# Altium project lps_regulator_rev_12.PrjPcb
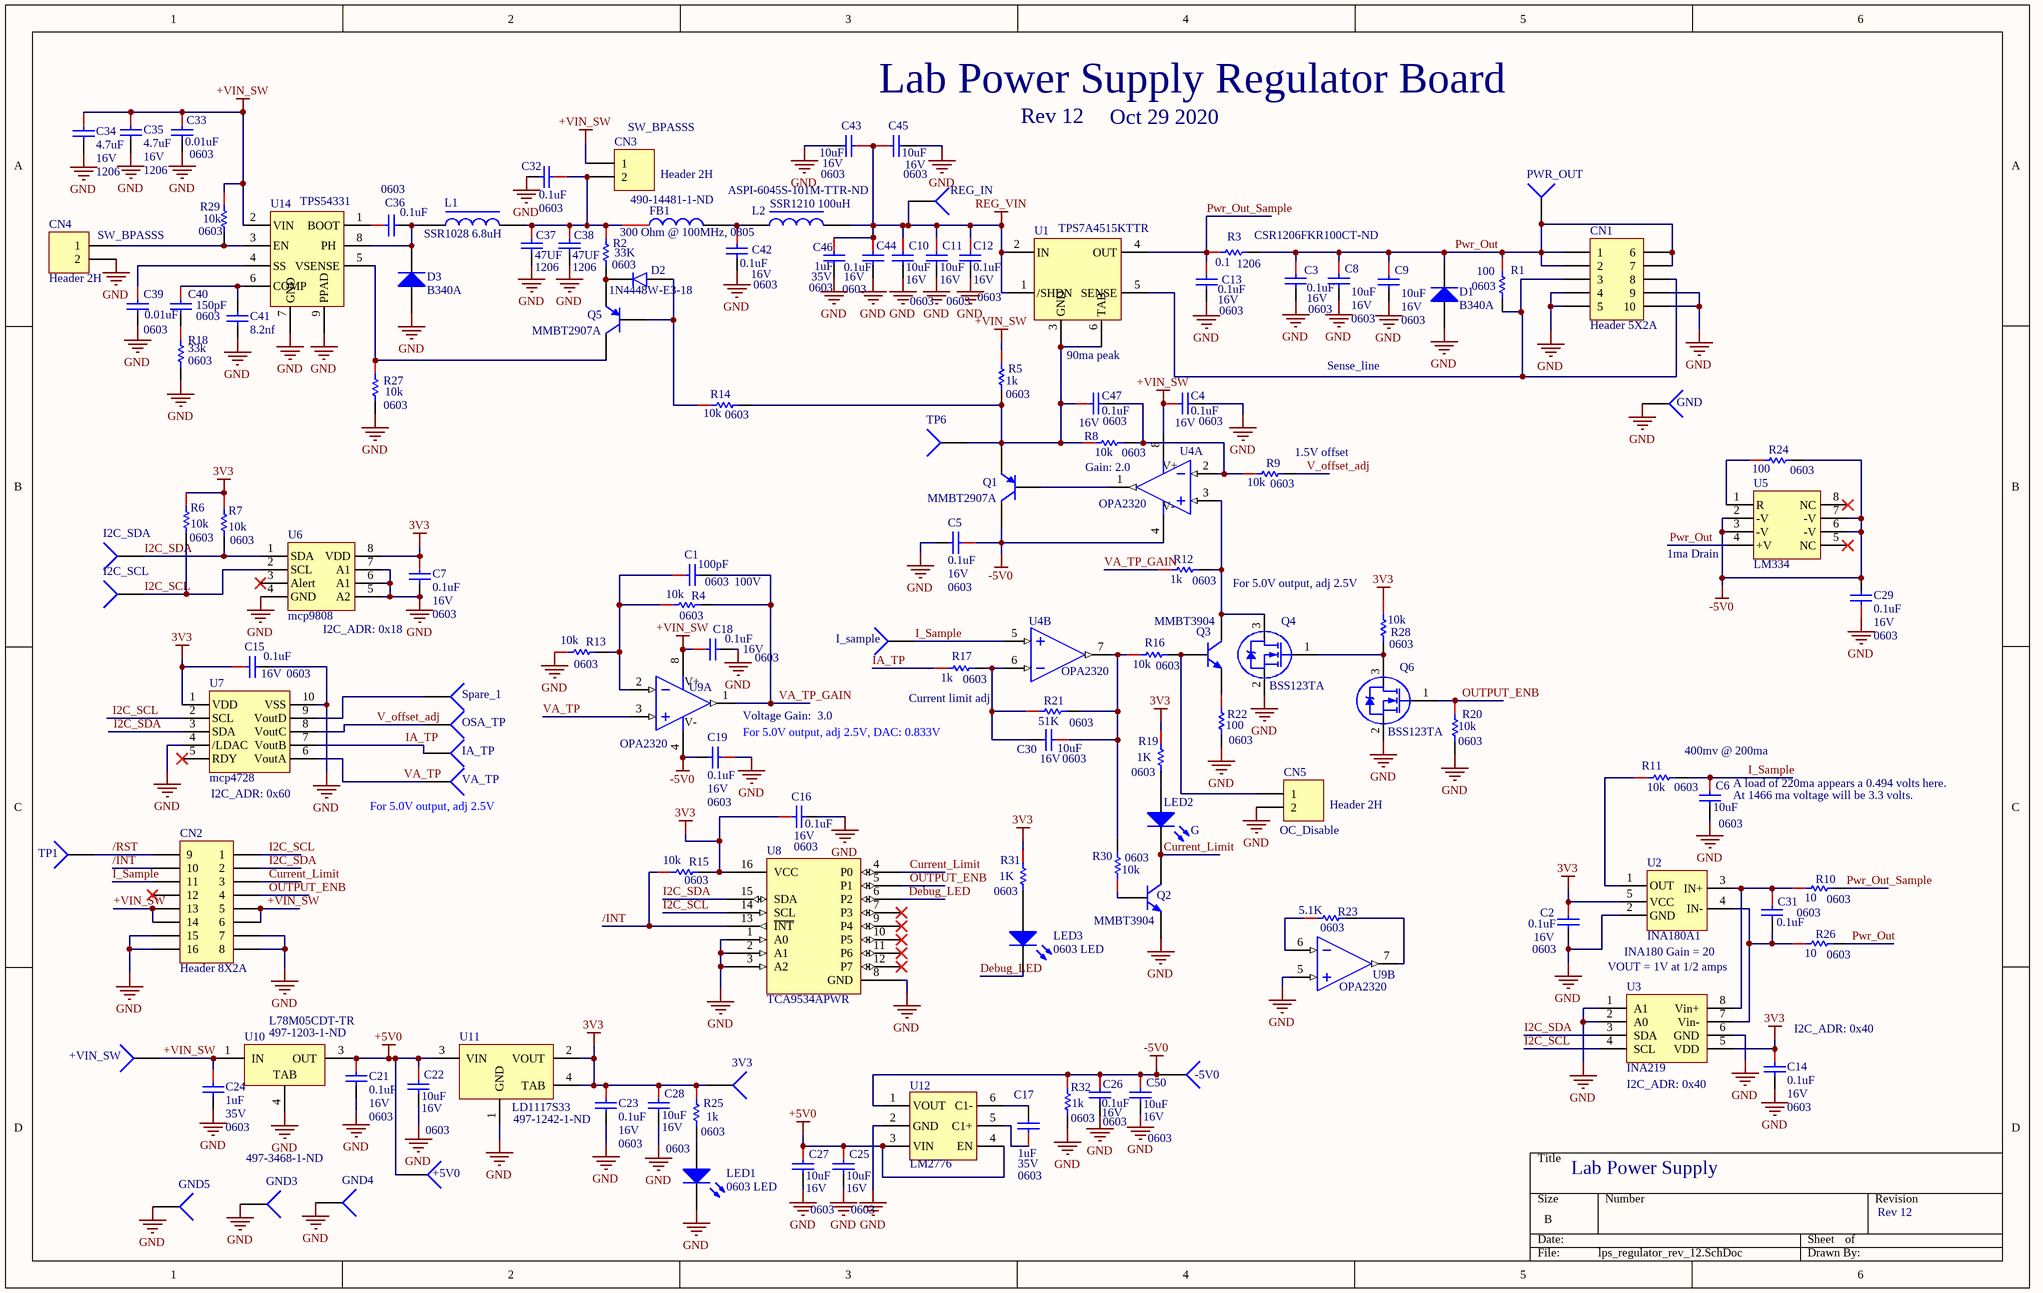
[diagram p0: lps_regulator_rev_12.SchDoc]
1 sheet, 131 parts. Net scope: global (net labels, ports and power ports of the same name join across sheets).
Board file: lps_regulator_rev_12.PcbDoc

## Sheet lps_regulator_rev_12.SchDoc
size B; Revision: B

### Parts
3V3  TestPoint_BLK  [TestPoint-TH 42 mil]  (value not drawn)
+5V0  TestPoint_BLK  [TestPoint-TH 42 mil]  (value not drawn)
+VIN_SW  TestPoint_BLK  [TestPoint-TH 42 mil]  (value not drawn)
-5V0  TestPoint_BLK  [TestPoint-TH 42 mil]  (value not drawn)
C1  100pF  Voltage (Rated): 100V  Package (Imperial): 0603  [CAPC0603(1608)_N]
C2  0.1uF  Voltage (Rated): 16V  Package (Imperial): 0603  [CAPC0603(1608)_M]
C3  0.1uF  Voltage (Rated): 16V  Package (Imperial): 0603  [CAPC0603(1608)_N]
C4  0.1uF  Voltage (Rated): 16V  Package (Imperial): 0603  [CAPC0603(1608)_N]
C5  0.1uF  Voltage (Rated): 16V  Package (Imperial): 0603  [CAPC0603(1608)_N]
C6  10uF  Package (Imperial): 0603  [CAPC0603(1608)_N]
C7  0.1uF  Voltage (Rated): 16V  Package (Imperial): 0603  [CAPC0603(1608)_N]
C8  10uF  Voltage (Rated): 16V  Package (Imperial): 0603  [CAPC0603(1608)_N]
C9  10uF  Voltage (Rated): 16V  Package (Imperial): 0603  [CAPC0603(1608)_N]
C10  10uF  Voltage (Rated): 16V  Package (Imperial): 0603  [CAPC0603(1608)_N]
C11  10uF  Voltage (Rated): 16V  Package (Imperial): 0603  [CAPC0603(1608)_N]
C12  0.1uF  Voltage (Rated): 16V  Package (Imperial): 0603  [CAPC0603(1608)_N]
C13  0.1uF  Voltage (Rated): 16V  Package (Imperial): 0603  [CAPC0603(1608)_N]
C14  0.1uF  Voltage (Rated): 16V  Package (Imperial): 0603  [CAPC0603(1608)_N]
C15  0.1uF  Voltage (Rated): 16V  Package (Imperial): 0603  [CAPC0603(1608)_N]
C16  0.1uF  Voltage (Rated): 16V  Package (Imperial): 0603  [CAPC0603(1608)_N]
C17  1uF  Voltage (Rated): 35V  Package (Imperial): 0603  [CAPC0603(1608)_N]
C18  0.1uF  Voltage (Rated): 16V  Package (Imperial): 0603  [CAPC0603(1608)_N]
C19  0.1uF  Voltage (Rated): 16V  Package (Imperial): 0603  [CAPC0603(1608)_N]
C21  0.1uF  Voltage (Rated): 16V  Package (Imperial): 0603  [CAPC0603(1608)_N]
C22  10uF  Voltage (Rated): 16V  Package (Imperial): 0603  [CAPC0603(1608)_N]
C23  0.1uF  Voltage (Rated): 16V  Package (Imperial): 0603  [CAPC0603(1608)_N]
C24  1uF  Voltage (Rated): 35V  Package (Imperial): 0603  [CAPC0603(1608)_N]
C25  10uF  Voltage (Rated): 16V  Package (Imperial): 0603  [CAPC0603(1608)_N]
C26  0.1uF  Voltage (Rated): 16V  Package (Imperial): 0603  [CAPC0603(1608)_N]
C27  10uF  Voltage (Rated): 16V  Package (Imperial): 0603  [CAPC0603(1608)_N]
C28  10uF  Voltage (Rated): 16V  Package (Imperial): 0603  [CAPC0603(1608)_N]
C29  0.1uF  Voltage (Rated): 16V  Package (Imperial): 0603  [CAPC0603(1608)_N]
C30  10uF  Voltage (Rated): 16V  Package (Imperial): 0603  [CAPC0603(1608)_N]
C31  0.1uF  Package (Imperial): 0603  [CAPC0603(1608)_N]
C32  0.1uF  Package (Imperial): 0603  [CAPC0603(1608)_N]
C33  0.01uF  Package (Imperial): 0603  [CAPC0603(1608)_N]
C34  4.7uF  Voltage (Rated): 16V  Package (Imperial): 1206  [CAPC1206(3216)_N]
C35  4.7uF  Voltage (Rated): 16V  Package (Imperial): 1206  [CAPC1206(3216)_N]
C36  0.1uF  Package (Imperial): 0603  [CAPC0603(1608)_N]
C37  47UF  Package (Imperial): 1206  [CAPC1206(3216)_N]
C38  47UF  Package (Imperial): 1206  [CAPC1206(3216)_N]
C39  0.01uF  Package (Imperial): 0603  [CAPC0603(1608)_N]
C40  150pF  Package (Imperial): 0603  [CAPC0603(1608)_N]
C41  8.2nf  [CAPC1608X87X35ML15T15]
C42  0.1uF  Voltage (Rated): 16V  Package (Imperial): 0603  [CAPC0603(1608)_N]
C43  10uF  Voltage (Rated): 16V  Package (Imperial): 0603  [CAPC0603(1608)_N]
C44  0.1uF  Voltage (Rated): 16V  Package (Imperial): 0603  [CAPC0603(1608)_N]
C45  10uF  Voltage (Rated): 16V  Package (Imperial): 0603  [CAPC0603(1608)_N]
C46  1uF  Voltage (Rated): 35V  Package (Imperial): 0603  [CAPC0603(1608)_N]
C47  0.1uF  Voltage (Rated): 16V  Package (Imperial): 0603  [CAPC0603(1608)_N]
C50  10uF  Voltage (Rated): 16V  Package (Imperial): 0603  [CAPC0603(1608)_N]
CN1  Header 5X2A  [HDR2X5_CEN]
CN2  Header 8X2A  [HDR2X8_CEN]
CN3  Header 2H  [HDR1X2H]
CN4  Header 2H  [HDR1X2H]
CN5  Header 2H  [HDR1X2H]
D1  B340A  [DO-214AC]
D2  1N4448W-E3-18  [SOD123]
D3  B340A  [DO-214AC]
FB1  300 Ohm @ 100MHz, 0805  [RESC0805(2012)_N]
GND  TestPoint_BLK  [TestPoint-TH 42 mil]  (value not drawn)
GND3  TestPoint_BLK  [TestPoint-TH 42 mil]  (value not drawn)
GND4  TestPoint_BLK  [TestPoint-TH 42 mil]  (value not drawn)
GND5  TestPoint_BLK  [TestPoint-TH 42 mil]  (value not drawn)
I2C_SCL  TestPoint_BLK  [TestPoint-TH 42 mil]  (value not drawn)
I2C_SDA  TestPoint_BLK  [TestPoint-TH 42 mil]  (value not drawn)
I_sample  TestPoint_BLK  [TestPoint-TH 42 mil]  (value not drawn)
IA_TP  TestPoint_BLK  [TestPoint-TH 42 mil]  (value not drawn)
L1  SSR1028 6.8uH  [SRU1028]
L2  SSR1210 100uH  [SRR1210]
LED1  0603 LED  [SM-LED-0603]
LED2  G  [SM-LED-0603]
LED3  0603 LED  [SM-LED-0603]
OSA_TP  TestPoint_BLK  [TestPoint-TH 42 mil]  (value not drawn)
PWR_OUT  TestPoint_BLK  [TestPoint-TH 42 mil]  (value not drawn)
Q1  MMBT2907A  [SOT23]
Q2  MMBT3904  [SOT23]
Q3  MMBT3904  [SOT23]
Q4  BSS123TA  [SOT23-3L]
Q5  MMBT2907A  [SOT23]
Q6  BSS123TA  [SOT23-3L]
R1  Package (Imperial): 0603  [RESC0603(1608)_N]  (hidden comment: 100)
R2  Package (Imperial): 0603  Resistance: 33K  [RESC0603(1608)_N]  (hidden comment: 10K)
R3  Package (Imperial): 1206  Resistance: 0.1  [RESC1206(3216)_N]  (hidden comment: 0.33)
R4  Package (Imperial): 0603  [RESC0603(1608)_M]  (hidden comment: 10k)
R5  Package (Imperial): 0603  Resistance: 1k  [RESC0603(1608)_N]  (hidden comment: 10K)
R6  Package (Imperial): 0603  [RESC0603(1608)_N]  (hidden comment: 10K)
R7  Package (Imperial): 0603  [RESC0603(1608)_N]  (hidden comment: 10K)
R8  Package (Imperial): 0603  [RESC0603(1608)_N]  (hidden comment: 10K)
R9  Package (Imperial): 0603  [RESC0603(1608)_N]  (hidden comment: 10K)
R10  Package (Imperial): 0603  Resistance: 10  [RESC0603(1608)_M]  (hidden comment: 10K)
R11  Package (Imperial): 0603  [RESC0603(1608)_M]  (hidden comment: 10K)
R12  Package (Imperial): 0603  Resistance: 1k  [RESC0603(1608)_N]  (hidden comment: 1.0K)
R13  Package (Imperial): 0603  [RESC0603(1608)_M]  (hidden comment: 10k)
R14  Package (Imperial): 0603  [RESC0603(1608)_N]  (hidden comment: 10K)
R15  Package (Imperial): 0603  [RESC0603(1608)_M]  (hidden comment: 10k)
R16  Package (Imperial): 0603  Resistance: 10k  [RESC0603(1608)_N]  (hidden comment: 1.0K)
R17  Package (Imperial): 0603  Resistance: 1k  [RESC0603(1608)_N]  (hidden comment: 1.0K)
R18  Package (Imperial): 0603  [RESC0603(1608)_N]  (hidden comment: 33K)
R19  Package (Imperial): 0603  Resistance: 1K  [RESC0603(1608)_N]  (hidden comment: 1.0K)
R20  Package (Imperial): 0603  [RESC0603(1608)_N]  (hidden comment: 10K)
R21  Package (Imperial): 0603  Resistance: 51K  [RESC0603(1608)_N]  (hidden comment: 100K)
R22  Package (Imperial): 0603  Resistance: 100  [RESC0603(1608)_N]  (hidden comment: 1.0K)
R23  Package (Imperial): 0603  Resistance: 5.1K  [RESC0603(1608)_N]  (hidden comment: 100)
R24  Package (Imperial): 0603  [RESC0603(1608)_N]  (hidden comment: 100)
R25  Package (Imperial): 0603  Resistance: 1k  [RESC0603(1608)_N]  (hidden comment: 1.0K)
R26  Package (Imperial): 0603  Resistance: 10  [RESC0603(1608)_M]  (hidden comment: 10K)
R27  Package (Imperial): 0603  [RESC0603(1608)_L]  (hidden comment: 10K)
R28  Package (Imperial): 0603  [RESC0603(1608)_N]  (hidden comment: 10K)
R29  Package (Imperial): 0603  [RESC0603(1608)_N]  (hidden comment: 10K)
R30  Package (Imperial): 0603  Resistance: 10k  [RESC0603(1608)_N]  (hidden comment: 1.0K)
R31  Package (Imperial): 0603  Resistance: 1K  [RESC0603(1608)_N]  (hidden comment: 1.0K)
R32  Package (Imperial): 0603  Resistance: 1k  [RESC0603(1608)_N]  (hidden comment: 1.0K)
REG_IN  TestPoint_BLK  [TestPoint-TH 42 mil]  (value not drawn)
Spare_1  TestPoint_BLK  [TestPoint-TH 42 mil]  (value not drawn)
TP1  TestPoint_BLK  [TestPoint-TH 42 mil]  (value not drawn)
TP6  TestPoint_BLK  [TestPoint-TH 42 mil]  (value not drawn)
U1  TPS7A4515KTTR  [TPS7A4515KTTR]
U2  INA180A1  [SOT-23-5_MC]
U3  INA219  [INA219]
U4  OPA2320  [SOIC-8_NoPad]  (parts A,B of 2)
U5  LM334  [LM334]
U6  mcp9808  [8MSOP]
U7  mcp4728  [MCP4728]
U8  TCA9534APWR  [TCA9534APWR-Footprint-1]
U9  OPA2320  [SOIC-8_NoPad]  (parts A,B of 2)
U10  (no value)  [TO-252_N]
U11  LD1117S33  [DSO-G3]
U12  LM2776  [SOt-23-6]
U14  TPS54331  [TPS54331]
VA_TP  TestPoint_BLK  [TestPoint-TH 42 mil]  (value not drawn)

### Nets
3V3: 3V3.1 C2.1 C7.1 C14.1 C15.1 C16.1 C23.1 C28.1 R6.1 R7.1 R15.2 R19.1 R25.1 R28.1 R31.1 U2.5(VCC) U3.5(VDD) U6.8(VDD) U7.1(VDD) U8.16(VCC) U11.2(VOUT) U11.4(TAB)
+5V0: +5V0.1 C21.1 C22.1 C25.1 C27.1 U10.3(OUT) U11.3(VIN) U12.3(VIN) U12.4(EN)
+VIN_SW: +VIN_SW.1 C4.1 C18.1 C24.1 C33.1 C34.1 C35.1 CN2.5 CN2.6 CN2.13 CN2.14 CN3.1 R5.1 R29.1 U4.8(V+) U9.8(V+) U10.1(IN) U14.2(VIN)
-5V0: -5V0.1 C5.1 C19.2 C26.1 C29.2 C50.1 Q1.3(C) R24.2 R32.1 U4.4(V-) U5.2(-V) U5.3(-V) U5.6(-V) U5.7(-V) U9.4(V-) U12.1(VOUT)
GND: C2.2 C3.2 C4.2 C5.2 C6.2 C7.2 C8.2 C9.2 C10.2 C11.2 C12.2 C13.2 C14.2 C15.2 C16.2 C18.2 C19.1 C21.2 C22.2 C23.2 C24.2 C25.2 C26.2 C27.2 C28.2 C29.1 C32.2 C33.2 C34.2 C35.2 C37.2 C38.2 C39.2 C41.1 C42.2 C43.2 C44.2 C45.2 C46.2 C50.2 CN1.4 CN1.5 CN1.9 CN1.10 CN2.7 CN2.8 CN2.15 CN2.16 CN4.2 CN5.2 D1.1(A) D3.1(A) GND.1 GND3.1 GND4.1 GND5.1 LED1.2(Cathode) Q2.2(E) Q4.2(S) Q6.2(S) R13.1 R18.2 R20.2 R22.2 R27.2 R32.2 U2.2(GND) U3.1(A1) U3.2(A0) U3.6(GND) U6.4(GND) U6.5(A2) U6.6(A1) U6.7(A1) U7.4(/LDAC) U7.10(VSS) U8.1(A0) U8.2(A1) U8.3(A2) U8.8(GND) U9.5(INB+) U10.4(TAB) U11.1(GND) U12.2(GND) U14.7(GND) U14.9(PPAD)
REG_VIN: C10.1 C11.1 C12.1 C43.1 C44.1 C45.1 C46.1 L2.2 REG_IN.1 U1.1(/SHDN) U1.2(IN)
/INT: CN2.10 R15.1 U8.13(~{INT})
/RST: CN2.9 TP1.1
Current_Limit: CN2.3 LED2.2 Q2.3(C) U8.4(P0)
Debug_LED: LED3.2(Cathode) U8.6(P2)
I2C_SCL: CN2.1 I2C_SCL.1 R6.2 U3.4(SCL) U6.2(SCL) U7.2(SCL) U8.14(SCL)
I2C_SDA: CN2.2 I2C_SDA.1 R7.2 U3.3(SDA) U6.1(SDA) U7.3(SDA) U8.15(SDA)
I_Sample: C6.1 CN2.11 I_sample.1 R11.2 U4.5(INB+)
IA_TP: IA_TP.1 R17.1 U7.7(VoutB)
OUTPUT_ENB: CN2.4 Q6.1(G) R20.1 U8.5(P1)
Pwr_Out: C3.1 C8.1 C9.1 CN1.1 CN1.2 CN1.6 CN1.7 D1.2(K) PWR_OUT.1 R1.1 R3.2 R26.2 U5.4(+V)
Pwr_Out_Sample: C13.1 R3.1 R10.2 U1.4(OUT)
V_offset_adj: OSA_TP.1 R9.2 U7.8(VoutC)
VA_TP: U7.6(VoutA) U9.3(INA+) VA_TP.1
VA_TP_GAIN: C1.2 R4.2 R12.1 U9.1(OUTA)
NetC1_1: C1.1 R4.1 R13.2 U9.2(INA-)
NetC17_1: C17.1 U12.5(C1+)
NetC17_2: C17.2 U12.6(C1-)
NetC30_1: C30.1 R16.1 R21.2 R30.2 U4.7(OUTB)
NetC30_2: C30.2 R17.2 R21.1 U4.6(INB-)
NetC31_1: C31.1 R10.1 U2.3(IN+) U3.8(Vin+)
NetC31_2: C31.2 R26.1 U2.4(IN-) U3.7(Vin-)
NetC32_1: C32.1 C37.1 C38.1 CN3.2 FB1.1 L1.2 R2.1
NetC36_1: C36.1 U14.1(BOOT)
NetC36_2: C36.2 D3.2(K) L1.1 U14.8(PH)
NetC39_1: C39.1 U14.4(SS)
NetC40_1: C40.1 C41.2 U14.6(COMP)
NetC40_2: C40.2 R18.1
NetC42_1: C42.1 FB1.2 L2.1
NetC47_1: C47.1 Q1.2(E) R5.2 R8.1 R14.2 TP6.1 U1.3(GND) U1.6(TAB)
NetC47_2: C47.2 R8.2 R9.1 U4.2(INA-)
NetCN1_3: CN1.3 CN1.8 R1.2 U1.5(SENSE)
NetCN4_1: CN4.1 R29.2 U14.3(EN)
NetCN5_1: CN5.1 Q3.1(B) R16.2
NetD2_1: D2.1(A) Q5.1(B) R14.1
NetD2_2: D2.2(C) Q5.2(E) R2.2
NetLED1_1: LED1.1(Anode) R25.2
NetLED2_1: LED2.1 R19.2
NetLED3_1: LED3.1(Anode) R31.2
NetQ1_1: Q1.1(B) U4.1(OUTA)
NetQ2_1: Q2.1(B) R30.1
NetQ3_2: Q3.2(E) R22.1
NetQ3_3: Q3.3(C) Q4.3(D) R12.2 U4.3(INA+)
NetQ4_1: Q4.1(G) Q6.3(D) R28.2
NetQ5_3: Q5.3(C) R27.1 U14.5(VSENSE)
NetR11_1: R11.1 U2.1(OUT)
NetR23_1: R23.1 U9.6(INB-)
NetR23_2: R23.2 U9.7(OUTB)
NetR24_1: R24.1 U5.1(R)
NetSpare_1_1: Spare_1.1 U7.9(VoutD)

Not connected (* = marked no-connect by the designer): CN2 12*; U5 5(NC)* 8(NC)*; U6 3(Alert)*; U7 5(RDY)*; U8 7(P3)* 9(P4)* 10(P5)* 11(P6)* 12(P7)*

### Notes on the sheet
- Lab Power Supply Regulator Board
- (near CN3) SW_BPASSS
- Rev 12
- Oct 29 2020
- 490-14481-1-ND
- ASPI-6045S-101M-TTR-ND
- (near CN4) SW_BPASSS
- (near R3) CSR1206FKR100CT-ND
- 90ma peak
- Sense_line
- (near U4) Gain: 2.0
- (near R9) 1.5V offset
- (near U5) 1ma Drain
- I2C_ADR: 0x18
- For 5.0V output, adj 2.5V
- Current limit adj
- Voltage Gain:  3.0
- For 5.0V output, adj 2.5V, DAC: 0.833V
- 400mv @ 200ma
- (near U7) I2C_ADR: 0x60
- (near VA_TP) For 5.0V output, adj 2.5V
- (near CN5) OC_Disable
- (near C6) A load of 220ma appears a 0.494 volts here.
- (near C6) At 1466 ma voltage will be 3.3 volts.
- VOUT = 1V at 1/2 amps
- INA180 Gain = 20
- L78M05CDT-TR
- (near U10) 497-1203-1-ND
- (near C14) I2C_ADR: 0x40
- (near U3) I2C_ADR: 0x40
- 497-3468-1-ND
- 497-1242-1-ND
- Lab Power Supply

### Library data of the parts
3V3 +5V0 +VIN_SW -5V0 GND GND3-GND5 I2C_SCL I2C_SDA I_sample IA_TP OSA_TP PWR_OUT REG_IN Spare_1 TP1 TP6 VA_TP = CMP-005-0210-01: Test Point - Black; Manufacturer Part Number: 5001; Manufacturer: Keystone Electronics; Stock 1: 335679; Material: Base, Nylon 46, UL 94V-0; Terminal: 0.010" x 0.020" (0.25mm x 0.51mm) Phosphor Bronze Wire, Silver Plated; ComponentLink1URL: http://www.keyelco.com/product-pdf.cfm?p=1310; Packaging: Bulk; Mounting Type: 0.040" (1.02mm) Hole Diameter; Color: Black; Pin Count: 1; Component Name: TestPoint_BLK; Pricing 1: 1=0.37, 10=0.316, 50=0.2298, 100=0.2209, 250=0.19832, 500=0.18932, 1000=0.1616, 2500=0.14424, 5000=0.13523 (USD); ComponentLink1Description: http://www.keyelco.com/product-pdf.cfm?p=1310; RoHS: RoHS Compliant; Designator: TestPoint_BLK; Type: PC Test Point, Miniature
C1 = CMP-007-0074-08: CAP CER 100PF 50V 5% NP0 0603; Package (Metric): 1608; Dielectric Material: Ceramic; Temperature Coefficient: C0G, NP0; Capacitance: 100pF; Tolerance: 5%; Mounting Type: SMD
C2-C5 C7 C12-C16 C18 C19 C21 C23 C26 C29-C32 C36 C42 C44 C47 = CMP-007-0042-08: CAP CER 0.1UF 16V 10% X7R 0603; Package (Metric): 1608; Dielectric Material: Ceramic; Capacitance: 100nF; Tolerance: 10%; Temperature Coefficient: X7R; Mounting Type: SMD
  C31 C32 C36: Voltage (Rated): 16V
C6 C8-C11 C22 C25 C27 C28 C43 C45 C50 = CMP-001-0603-12: CAP CER 10UF 16V X5R 0603; Capacitance: 10µF; Tolerance: 10%; Package (Metric): 1005; Dielectric Material: Ceramic; Temperature (Max): 85°C; Temperature (Min): -55°C; Height: 800µm; Mounting Type: SMD; Width: 800µm; Temperature Coefficient: X5R
  C6: Voltage (Rated): 16V
C17 C24 C40 C46 = CMP-007-0109-08: CAP CER 1UF 35V 10% X5R 0603; Temperature (Min): -55°C; Temperature (Max): 85°C; Dielectric Material: Ceramic; Package (Metric): 1608; Capacitance: 1µF; Length: 1.6mm; Mounting Type: SMD; Height: 900µm; Tolerance: 10%; Temperature Coefficient: X5R; Width: 800µm
  C40: Voltage (Rated): 35V
C33 = CMP-007-0028-08: CAP CER 0.01uF 50V 10% X7R 0603; Temperature (Max): 125°C; Temperature (Min): -55°C; Dielectric Material: Ceramic; Capacitance: 10nF; Package (Metric): 1608; Voltage (Rated): 50V; Height: 900µm; Mounting Type: SMD; Temperature Coefficient: X7R; Width: 800µm; Tolerance: 10%; Length: 1.6mm
C34 C35 = CMP-007-0147-08: CAP CER 4.7UF 50V 10% X7R 1206; Capacitance: 4.7µF; Dielectric Material: Ceramic; Package (Metric): 3216; Mounting Type: SMD; Temperature Coefficient: X7R; Tolerance: 10%
C37 C38 = CMP-001-0623-11: CAP CER 47UF 25V 1206; Voltage (Rated): 100V; Temperature (Max): 85°C; Capacitance: 47µF; Temperature Coefficient: X5R; Package (Metric): 3216; Tolerance: 20%; Dielectric Material: Ceramic; Temperature (Min): -55°C; Length: 3.2mm; Mounting Type: SMD; Height: 1.6mm
C39 = CMP-007-0128-08: CAP CER 22PF 50V 5% NP0 0603; Dielectric Material: Ceramic; Package (Metric): 1608; Temperature Coefficient: C0G, NP0; Voltage (Rated): 50V; Tolerance: 5%; Capacitance: 22pF; Mounting Type: SMD
C41 = CMP-001-0751-01: CAP CER 820PF 50V X7R 0603; Dielectric Material: Ceramic; Dissipation Factor: 2.5%; Tolerance: 10%; Voltage Rating: 50V; REACH SVHC: No SVHC; Width: 0.8mm; Thickness: 0.034inch; Voltage Rating (DC): 50V; Mount: PCB, Surface Mount; Case Code (Imperial): 0603; Case/Package: 0603; Package Quantity: 1; Contact Plating: Matte, Tin; Length: 1.6mm; Min Operating Temperature: -55°C; Case Code (Metric): 1608; Capacitance: 820pF; Height: 0.8mm; Depth: 0.8mm; Lead Pitch: 0.7mm; Max Operating Temperature: 125°C; Voltage: 50V; Dielectric: X7R; Radiation Hardening: No; Packaging: Tape and Reel; Termination: SMD/SMT
CN1 = CMP-001-0310-01: Header, 5-Pin, Dual row; Signal Integrity: Connector; Designator: Header 5X2A; Component Name: Header 5X2A; LatestRevisionDate: 17-Jul-2002; LatestRevisionNote: Re-released for DXP Platform.; Pin Count: 10; Publisher: Altium Limited
CN2 = CMP-001-0325-01: Header, 8-Pin, Dual row; Signal Integrity: Connector; Publisher: Altium Limited; Designator: Header 8X2A; LatestRevisionNote: Re-released for DXP Platform.; Pin Count: 16; Component Name: Header 8X2A; LatestRevisionDate: 17-Jul-2002
CN3-CN5 = CMP-001-0287-01: Header, 2-Pin, Right Angle; Manufacturer Part Number: M20-9960245; Manufacturer: Harwin Inc.; Mated Stacking Heights: 11.72mm, 12.62mm, 12.72mm, 13.62mm, 18.22mm, 19.12mm; Style: Board to Board or Cable; Number of Positions Loaded: All; Signal Integrity: Connector; Number of Positions: 2; Current Rating: 3A per Contact; Shrouding: Unshrouded; Contact Length - Post: 0.118" (3.00mm); Connector Type: Header, Cuttable; Contact Length - Mating: 0.240" (6.10mm); Material Flammability Rating: UL94 V-0; Pitch - Mating: 0.100" (2.54mm); Part Status: Active; Designator: Header 2H; Packaging: Bulk; Contact Finish - Post: -; Contact Material: Brass; Publisher: Altium Limited; Applications: -; Insulation Height: 0.100" (2.54mm); Number of Rows: 1; Ingress Protection: -; Pricing 1: 1=0.15, 10=0.141, 100=0.087, 500=0.072, 1000=0.063, 5000=0.054, 10000=0.0525 (USD); Contact Finish - Mating: Gold; Features: -; Component Name: Header 2H; Mounting Type: Through Hole, Right Angle; Overall Contact Length: -; LatestRevisionDate: 17-Jul-2002; RoHS: RoHS Compliant; Voltage Rating: -; Contact Finish Thickness - Mating: -; Contact Shape: Square; Termination: Solder; Row Spacing - Mating: -; Contact Finish Thickness - Post: -; Insulation Material: Polyamide (PA6T), Nylon 6T; Stock 1: 17504; ComponentLink1Description: https://cdn.harwin.com/pdfs/M20-996.pdf; LatestRevisionNote: Re-released for DXP Platform.; Pin Count: 2; Contact Type: Male Pin; ComponentLink1URL: https://cdn.harwin.com/pdfs/M20-996.pdf; Fastening Type: -; Operating Temperature: -40°C ~ 105°C; Insulation Color: Black
D1 D3 = CMP-001-0130-02: DIODE SCHOTTKY 60V 3A; Manufacturer: Micro Commercial Co; Capacitance @ Vr, F: 250pF @ 4V, 1MHz; Current - Reverse Leakage @ Vr: 500µA @ 60V; Voltage - Forward (Vf) (Max) @ If: 750mV @ 3A; Speed: Fast Recovery =< 500ns, > 200mA (Io); Operating Temperature - Junction: -50°C ~ 125°C; RoHS: RoHS Compliant; Package / Case: DO-214AC, SMA; ComponentLink1Description: http://www.mccsemi.com/up_pdf/SK32A-LT~SK310A-LT(DO-214AC).PDF; Packaging: Cut Tape (CT); Component Name: SK36A-LTP; ComponentLink1URL: http://www.mccsemi.com/up_pdf/SK32A-LT~SK310A-LT(DO-214AC).PDF; Designator: SK36A-LTP; Mounting Type: Surface Mount; Current - Average Rectified (Io): 3A; Supplier Device Package: DO-214AC (SMA); Part Status: Active; Manufacturer Part Number: SK36A-LTP; Pricing 1: 1=0.6, 10=0.42, 25=0.3448, 100=0.276, 250=0.20072, 500=0.1631, 1000=0.12545, 2500=0.11291 (USD); Diode Type: Schottky; Pin Count: 2; Stock 1: 26020
D2 = CMP-001-0983-02: Diodes - General Purpose, Power, Switching 100 Volt 500mA 4ns; Max Repetitive Reverse Voltage (Vrrm): 100V; Max Reverse Voltage (DC): 75V; Forward Current: 150mA; Element Configuration: Single; Max Reverse Leakage Current: 5uA; Max Power Dissipation: 500mW; Max Surge Current: 500mA; Recovery Time: 4ns; Peak Non-Repetitive Surge Current: 500mA; Min Operating Temperature: -55°C; Package Quantity: 10000; Reverse Recovery Time: 4ns; Weight: 0.000363oz; Mount: Surface Mount; Packaging: Tape and Reel; Contact Plating: Tin; Average Rectified Current: 150mA; Max Operating Temperature: 150°C
FB1 = CMP-007-0197-02: 600 Ohms @ 100MHz 1 Signal Line Ferrite Bead 0805 (2012 Metric) 2A 150mOhm; Manufacturer Part Number: 742792040; Manufacturer: Wurth Electronics Inc; Filter Type: Differential Mode - Single; Component Name: FERRITE 600 OHM 2.0A 0805; DC Resistance (DCR): 150 mOhm Max; Impedance @ Frequency: 600 Ohms @ 100MHz; Package: 0805 (2012 Metric); Size / Dimension: 0.079" L x 0.047" W (2.00mm x 1.20mm); RoHS: RoHS Compliant; Height (Max): 0.043" (1.10mm); ClassName: *; Pin Count: 2; Designator: FERRITE 600 OHM 2.0A 0805; Stock 1: 34670; Creator: osman; Packaging: Cut Tape (CT); Mounting Type: Surface Mount; Pricing 1: 1=0.24, 50=0.2344, 100=0.2156, 500=0.20624, 1000=0.19687, 2000=0.1875 (USD); ComponentLink1URL: http://katalog.we-online.de/pbs/datasheet/742792040.pdf; Current Rating: 2A; ComponentLink1Description: http://katalog.we-online.de/pbs/datasheet/742792040.pdf
L1 = CMP-001-0686-01: INDUCTOR 6.8uH  SMD; Manufacturer 1: Taiyo Yuden; Manufacturer Part Number 1: NRS8040T4R7NJGJV; Current Rating: 4.1A; Test Frequency: 100kHz; DC Resistance (DCR): 18mR; Saturation Current: 5.4A; Tolerance: 30%; Self Resonant Frequency: 30MHz; Core Material: Ferrite; Inductance: 4.7uh; Shielding: Shielded; Width: 0.315inch; Case/Package: 8040; Min Operating Temperature: -25°C; Packaging: Tape and Reel; Depth: 8.2mm; Max Operating Temperature: 125°C; Lead Free: Lead Free; Mount: Surface Mount; REACH SVHC: Unknown; Number of Pins: 2; Radiation Hardening: No; Height: 4.2mm; Inductance Tolerance: 30%; Package Quantity: 1000; Length: 8mm; RMS Current (Irms): 4.1A; Lead Pitch: 5.6mm; Max DC Current: 5.4A; Termination: SMD/SMT; Halogen Free: Halogen Free
L2 = CMP-001-0686-01: INDUCTOR 100uH 2.2A SMD; Manufacturer 1: Taiyo Yuden; Manufacturer Part Number 1: NRS8040T4R7NJGJV; Current Rating: 4.1A; Test Frequency: 100kHz; DC Resistance (DCR): 18mR; Saturation Current: 5.4A; Tolerance: 30%; Self Resonant Frequency: 30MHz; Core Material: Ferrite; Inductance: 4.7uh; Shielding: Shielded; Width: 0.315inch; Case/Package: 8040; Min Operating Temperature: -25°C; Packaging: Tape and Reel; Depth: 8.2mm; Max Operating Temperature: 125°C; Lead Free: Lead Free; Mount: Surface Mount; REACH SVHC: Unknown; Number of Pins: 2; Radiation Hardening: No; Height: 4.2mm; Inductance Tolerance: 30%; Package Quantity: 1000; Length: 8mm; RMS Current (Irms): 4.1A; Lead Pitch: 5.6mm; Max DC Current: 5.4A; Termination: SMD/SMT; Halogen Free: Halogen Free
LED1 LED3 = CMP-001-0009-04: 0603 SMD LED; Pin Count: 2; Designator: 0603 LED
LED2 = 0603 LED: 0603 SMD LED; PN: P11500CT-ND; Vendor: Digikey
Q1 Q5 = CMP-012-0075-02: PNP General Purpose Amplifier; Manufacturer: Fairchild Semiconductor; Voltage - Collector Emitter Breakdown (Max): 60V; DC Current Gain (hFE) (Min) @ Ic, Vce: 100 @ 150mA, 10V; Vce Saturation (Max) @ Ib, Ic: 1.6V @ 50mA, 500mA; Vendor: Digikey; Current - Collector (Ic) (Max): 800mA; Frequency - Transition: 200MHz; Power - Max: 350mW; PN: MMBT2907AFSCT-ND; Transistor Type: PNP; Manufacturer Part Number: MMBT2907A; Supplier Device Package: SOT-23; Mounting Type: Surface Mount; ComponentLink1URL: http://www.fairchildsemi.com/ds/MM/MMBT2907A.pdf; Component Name: MMBT2907A; ComponentLink1Description: http://www.fairchildsemi.com/ds/MM/MMBT2907A.pdf; Pricing 1: 1=0.2, 10=0.187, 25=0.17, 100=0.1224, 250=0.07208, 500=0.0598, 1000=0.04079 (USD); Current - Collector Cutoff (Max): -; Designator: MMBT2907A; Stock 1: 74892; Packaging: Cut Tape (CT); MPN: MMBT2907A; Pin Count: 3; Package / Case: TO-236-3, SC-59, SOT-23-3; RoHS: RoHS Compliant
Q2 Q3 = MMBT3904: NPN General Purpose Amplifier; Manufacturer: ON Semiconductor; MPN: MMBT3904WT1G; Vendor: Digikey; PN: MMBT3904WT1GOSCT-ND; Current - Collector (Ic) (Max): 200mA; Voltage - Collector Emitter Breakdown (Max): 40V; Vce Saturation (Max) @ Ib, Ic: 300mV @ 5mA, 50mA; DC Current Gain (hFE) (Min) @ Ic, Vce: 100 @ 10mA, 1V; Power - Max: 150mW; Frequency - Transition: 300MHz; Supplier 1: Digi-Key; Manufacturer Part Number: MMBT3904WT1G; RoHS: RoHS Compliant; Category: Discrete Semiconductor Products; Stock 1: 3; Pricing 1: 1=0.17, 10=0.154, 25=0.1404, 100=0.101, 250=0.05952, 500=0.04938, 1000=0.03368 (USD); Packaging: Cut Tape (CT); Transistor Type: NPN; Current - Collector Cutoff (Max): -; Mounting Type: Surface Mount; Package / Case: SC-70, SOT-323; Supplier Device Package: SC-70-3 (SOT323); ComponentLink1URL: http://www.onsemi.com/pub_link/Collateral/MMBT3904WT1-D.PDF; ComponentLink1Description: http://www.onsemi.com/pub_link/Collateral/MMBT3904WT1-D.PDF; Supplier Part Number 1: MMBT3904WT1GOSCT-ND
Q4 Q6 = CMP-012-0021-01: MOSFET N-CH 100V 170MA SOT23-3; Manufacturer: Diodes Incorporated; Drive Voltage (Max Rds On,  Min Rds On): 4.5V, 10V; Rds On (Max) @ Id, Vgs: 6 Ohm @ 100mA, 10V; FET Type: N-Channel; Vgs(th) (Max) @ Id: 2.8V @ 1mA; Power Dissipation (Max): 360mW (Ta); Vgs (Max): ±20V; Current - Continuous Drain (Id) @ 25°C: 170mA (Ta); Manufacturer Part Number: BSS123TA; Technology: MOSFET (Metal Oxide); Package / Case: TO-236-3, SC-59, SOT-23-3; ComponentLink1Description: https://www.diodes.com/assets/Datasheets/BSS123.pdf; Designator: BSS123TA; Component Name: BSS123TA; Pricing 1: 1=0.59, 10=0.418, 100=0.2742, 500=0.16202, 1000=0.12463 (USD); FET Feature: -; Operating Temperature: -55°C ~ 150°C (TJ); ComponentLink1URL: https://www.diodes.com/assets/Datasheets/BSS123.pdf; Packaging: Cut Tape (CT); Part Status: Active; Pin Count: 3; Stock 1: 35338; Mounting Type: Surface Mount; RoHS: RoHS Compliant; Supplier Device Package: SOT-23-3
R1 R23 R24 = CMP-007-0349-12: RES 100 OHM 1% 1/10W 0603 2017; Power: 100mW; Temperature Coefficient: ±100ppm/°C; Package (Metric): 1608; Termination: SMD/SMT; Tolerance: 1%; Height: 550µm; Operating Temperature: -55°C ~ 155°C
  R1 R24: Resistance: 100
R2 R5-R11 R14 R20 R26-R29 = CMP-007-0359-12: RES 10K OHM 1/10W 1% 0603 SMD; Package (Metric): 1608; Power: 100mW; Temperature Coefficient: ±100ppm/°C; Height: 550µm; Termination: SMD/SMT; Tolerance: 1%
  R6-R9 R11 R14 R20 R27-R29: Resistance: 10k
R3 = CMP-007-0323-14: RES 0.33 OHM 1% 1/4W 1206; Max Power Dissipation: 250mW; Temperature Coefficient: 200ppm/°C; Max Operating Temperature: 125°C; Radiation Hardening: No; Military Standard: Not; Composition: Thick Film; Package (Metric): 1206; Packaging: Tape and Reel; Number of Pins: 2; Termination: SMD/SMT; Min Operating Temperature: -55°C; Package Quantity: 1; Power: 250mW; Number of Terminations: 2; Features: Automotive AEC-Q200; Mount: Surface Mount; Width: 1.6mm; Contact Plating: Tin; Height: 600µm; Length: 3.2mm; Tolerance: 1%; Depth: 1.6mm; Power Rating: 250mW
R4 R13 R15 = CMP-007-0357-12: RES 10K OHM 0.1% 1/10W 0603; Power: 100mW; Package (Metric): 1608; Temperature Coefficient: ±25ppm/°C; Resistance: 10k; Tolerance: 0.1%; Height: 550µm; Termination: SMD/SMT; Operating Temperature: -55°C ~ 155°C
R12 R16 R17 R19 R22 R25 R30-R32 = CMP-007-0404-12: RES 1K OHM 1% 1/10W 0603; Temperature Coefficient: ±100ppm/°C; Power: 100mW; Package (Metric): 2012; Operating Temperature: -55°C ~ 155°C; Tolerance: 1%; Termination: SMD/SMT; Height: 550µm
R18 = CMP-007-0480-12: RES 33K OHM 1/10W 5% 0603 SMD; Temperature Coefficient: ±200ppm/°C; Power: 100mW; Package (Metric): 1608; Termination: SMD/SMT; Tolerance: 5%; Resistance: 33k; Height: 550µm
R21 = CMP-007-0353-12: RES 100K OHM 1% 1/10W 0603; Temperature Coefficient: ±100ppm/°C; Power: 100mW; Package (Metric): 1608; Operating Temperature: -55°C ~ 155°C; Tolerance: 1%; Height: 550µm; Termination: SMD/SMT
U1 = TPS7A4515KTTR: TPS7A4515KTTR, linear regulator
U3 = INA219: Current Monitor IC
U4 U9 = CMP-006-0027-01: Dual Single Supply Rail-to-Rail OpAmp; Manufacturer Part Number: OPA2320AIDR; Manufacturer: Texas Instruments; Amplifier Type: General Purpose; Voltage - Supply, Single/Dual (±): 1.8 V ~ 5.5 V, ±0.9 V ~ 2.75 V; Current - Supply: 1.45mA; Slew Rate: 10 V/µs; Source: OLogic-OpAmps.SCHLIB; Part Status: Active; Output Type: Rail-to-Rail; Packaging: Cut Tape (CT); Supplier Device Package: 8-SOIC; Pin Count: 8; Stock 1: 3660; RoHS: RoHS Compliant; Base Part Number: OPA2320; ComponentLink1Description: http://www.ti.com/lit/ds/symlink/opa2320.pdf; Component Name: OPA2320; Package / Case: 8-SOIC (0.154", 3.90mm Width); Designator: OPA2320; ComponentLink1URL: http://www.ti.com/lit/ds/symlink/opa2320.pdf; Mounting Type: Surface Mount; Operating Temperature: -40°C ~ 125°C; Pricing 1: 1=3, 10=2.697, 100=2.2094, 500=1.88078, 1000=1.5862 (USD)
U5 = LM334: LM334, Current source
U8 = CMP-001-1190-01: IC I/O EXPANDER I2C 8B 16TSSOP; Number of I/Os: 8; Frequency: 400kHz; Contact Plating: Gold; Lead Free: Lead Free; Min Operating Temperature: -40°C; Mount: Surface Mount; Case/Package: TSSOP; Max Operating Temperature: 85°C; Number of Outputs: 8; Packaging: Tape and Reel; Interface: I2C; Number of Pins: 16
U10 = CMP-001-0685-01: STMICROELECTRONICS         LD29150DT33R            Fixed LDO Voltage Regulator, 4.3V to 30V, 400mV Dropout, 3.3Vout, 1.5Aout, TO-252-3; Min Output Voltage: 3.3V; Reference Voltage: 1.2423V; Polarity: Positive; Output Voltage Accuracy: 1%; Number of Outputs: 1; Max Output Voltage: 3.333V; Max Output Current: 1.5A; Quiescent Current: 15mA; Min Operating Temperature: -40°C; Packaging: Tape and Reel; Case/Package: TO-252; Weight: 0.01lb; Min Input Voltage: 4.3V; Nominal Output Voltage: 3.3V; Termination: SMD/SMT; Output Voltage: 3.3V; Width: 6.2mm; Radiation Hardening: No; Accuracy: 1%; Lead Free: Lead Free; Number of Pins: 3; Contact Plating: Matte, Tin; Mount: Surface Mount; Package Quantity: 1; Number of Regulators: 1; Max Supply Voltage: 30V; Output Current: 1.5A; Output Type: Fixed; Dropout Voltage: 400mV; REACH SVHC: No SVHC; Min Supply Voltage: 4.3V; Input Bias Current: 15mA; Max Input Voltage: 30V; Height: 2.4mm; Max Operating Temperature: 125°C; Length: 6.6mm
U11 = CMP-008-0010-01: 3.3 volt fixed regulator, 800mA; Pin Count: 4; Designator: LD1117S33; Component Name: LD1117S33